# EAGLE schematic ff555 (EAGLE 9.2.2)
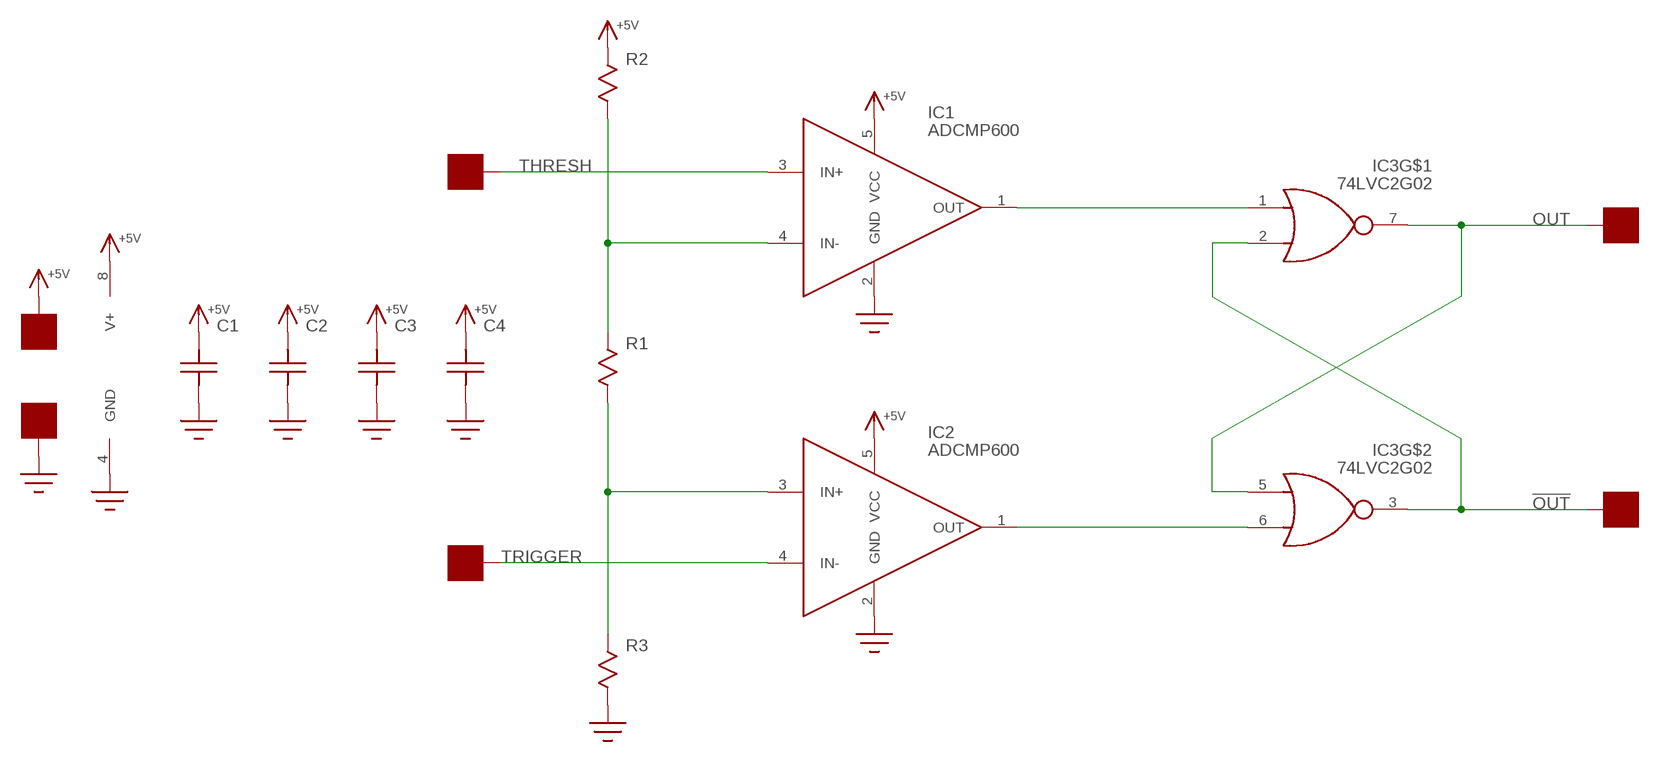
[diagram p0: schematic, sheet 1]

## Parts
C1  C0603  [C0603]
C2  C0603  [C0603]
C3  C0805  [0805]
C4  C0603  [C0603]
IC1  ADCMP600  [SOT23-5]
IC2  ADCMP600  [SOT23-5]
IC3  74LVC2G02  [TSSOP8]
R1  R0603  [R0603]
R2  R0603  [R0603]
R3  R0603  [R0603]
U$15  PAD100MIL  [PAD_100MIL]
U$16  PAD100MIL  [PAD_100MIL]
U$17  PAD100MIL  [PAD_100MIL]
U$18  PAD100MIL  [PAD_100MIL]
U$19  PAD100MIL  [PAD_100MIL]
U$20  PAD100MIL  [PAD_100MIL]

## Nets
!OUT!: IC3.2(B) IC3.3(Y) U$20.P$1
+5V: C1.P$2 C2.P$2 C3.P$2 C4.P$2 IC1.5(VCC) IC2.5(VCC) IC3.8(V+) R2.P$1 U$15.P$1
GND: C1.P$1 C2.P$1 C3.P$1 C4.P$1 IC1.2(GND) IC2.2(GND) IC3.4(GND) R3.P$2 U$16.P$1
N$1: IC1.4(IN-) R1.P$1 R2.P$2
N$2: IC2.3(IN+) R1.P$2 R3.P$1
N$3: IC1.1(OUT) IC3.1(A)
N$4: IC2.1(OUT) IC3.6(B)
OUT: IC3.5(A) IC3.7(Y) U$19.P$1
THRESH: IC1.3(IN+) U$17.P$1
TRIGGER: IC2.4(IN-) U$18.P$1

## Library data of the parts
C1-C4 = yapo:C
IC1 IC2 = yapo:ADCMP600
IC3 = yapo:74LVC2G02
R1-R3 = yapo:R
U$15-U$20 = yapo:PAD